# Altium schematic sheet Cpcis_connectors_P4_P5_P6.SchDoc: CPCIS Backplane
size 420 x 297 mm; CheckedBy: A.Paixao; CompanyName: CERN; DrawnBy: G. Daniluk; Engineer: G. Daniluk; Organization: CERN; Address1: European Organization for Nuclear Research; Address2: CH-1211 Genève 23 - Switzerland; DocumentNumber: 19; Revision: -; SheetNumber: 19; SheetTotal: 19; EDA_Number: EDA-03828-V1-0; Projet: DIOT Demonstrator System Board (based on C-GEFE v1); ModifiedBy: G. Daniluk; CheckedDate: 18/06/2018; Title2: P5 to P6; DivGrp: BE/CO; Designer: G. Daniluk; ModifiedDate: -
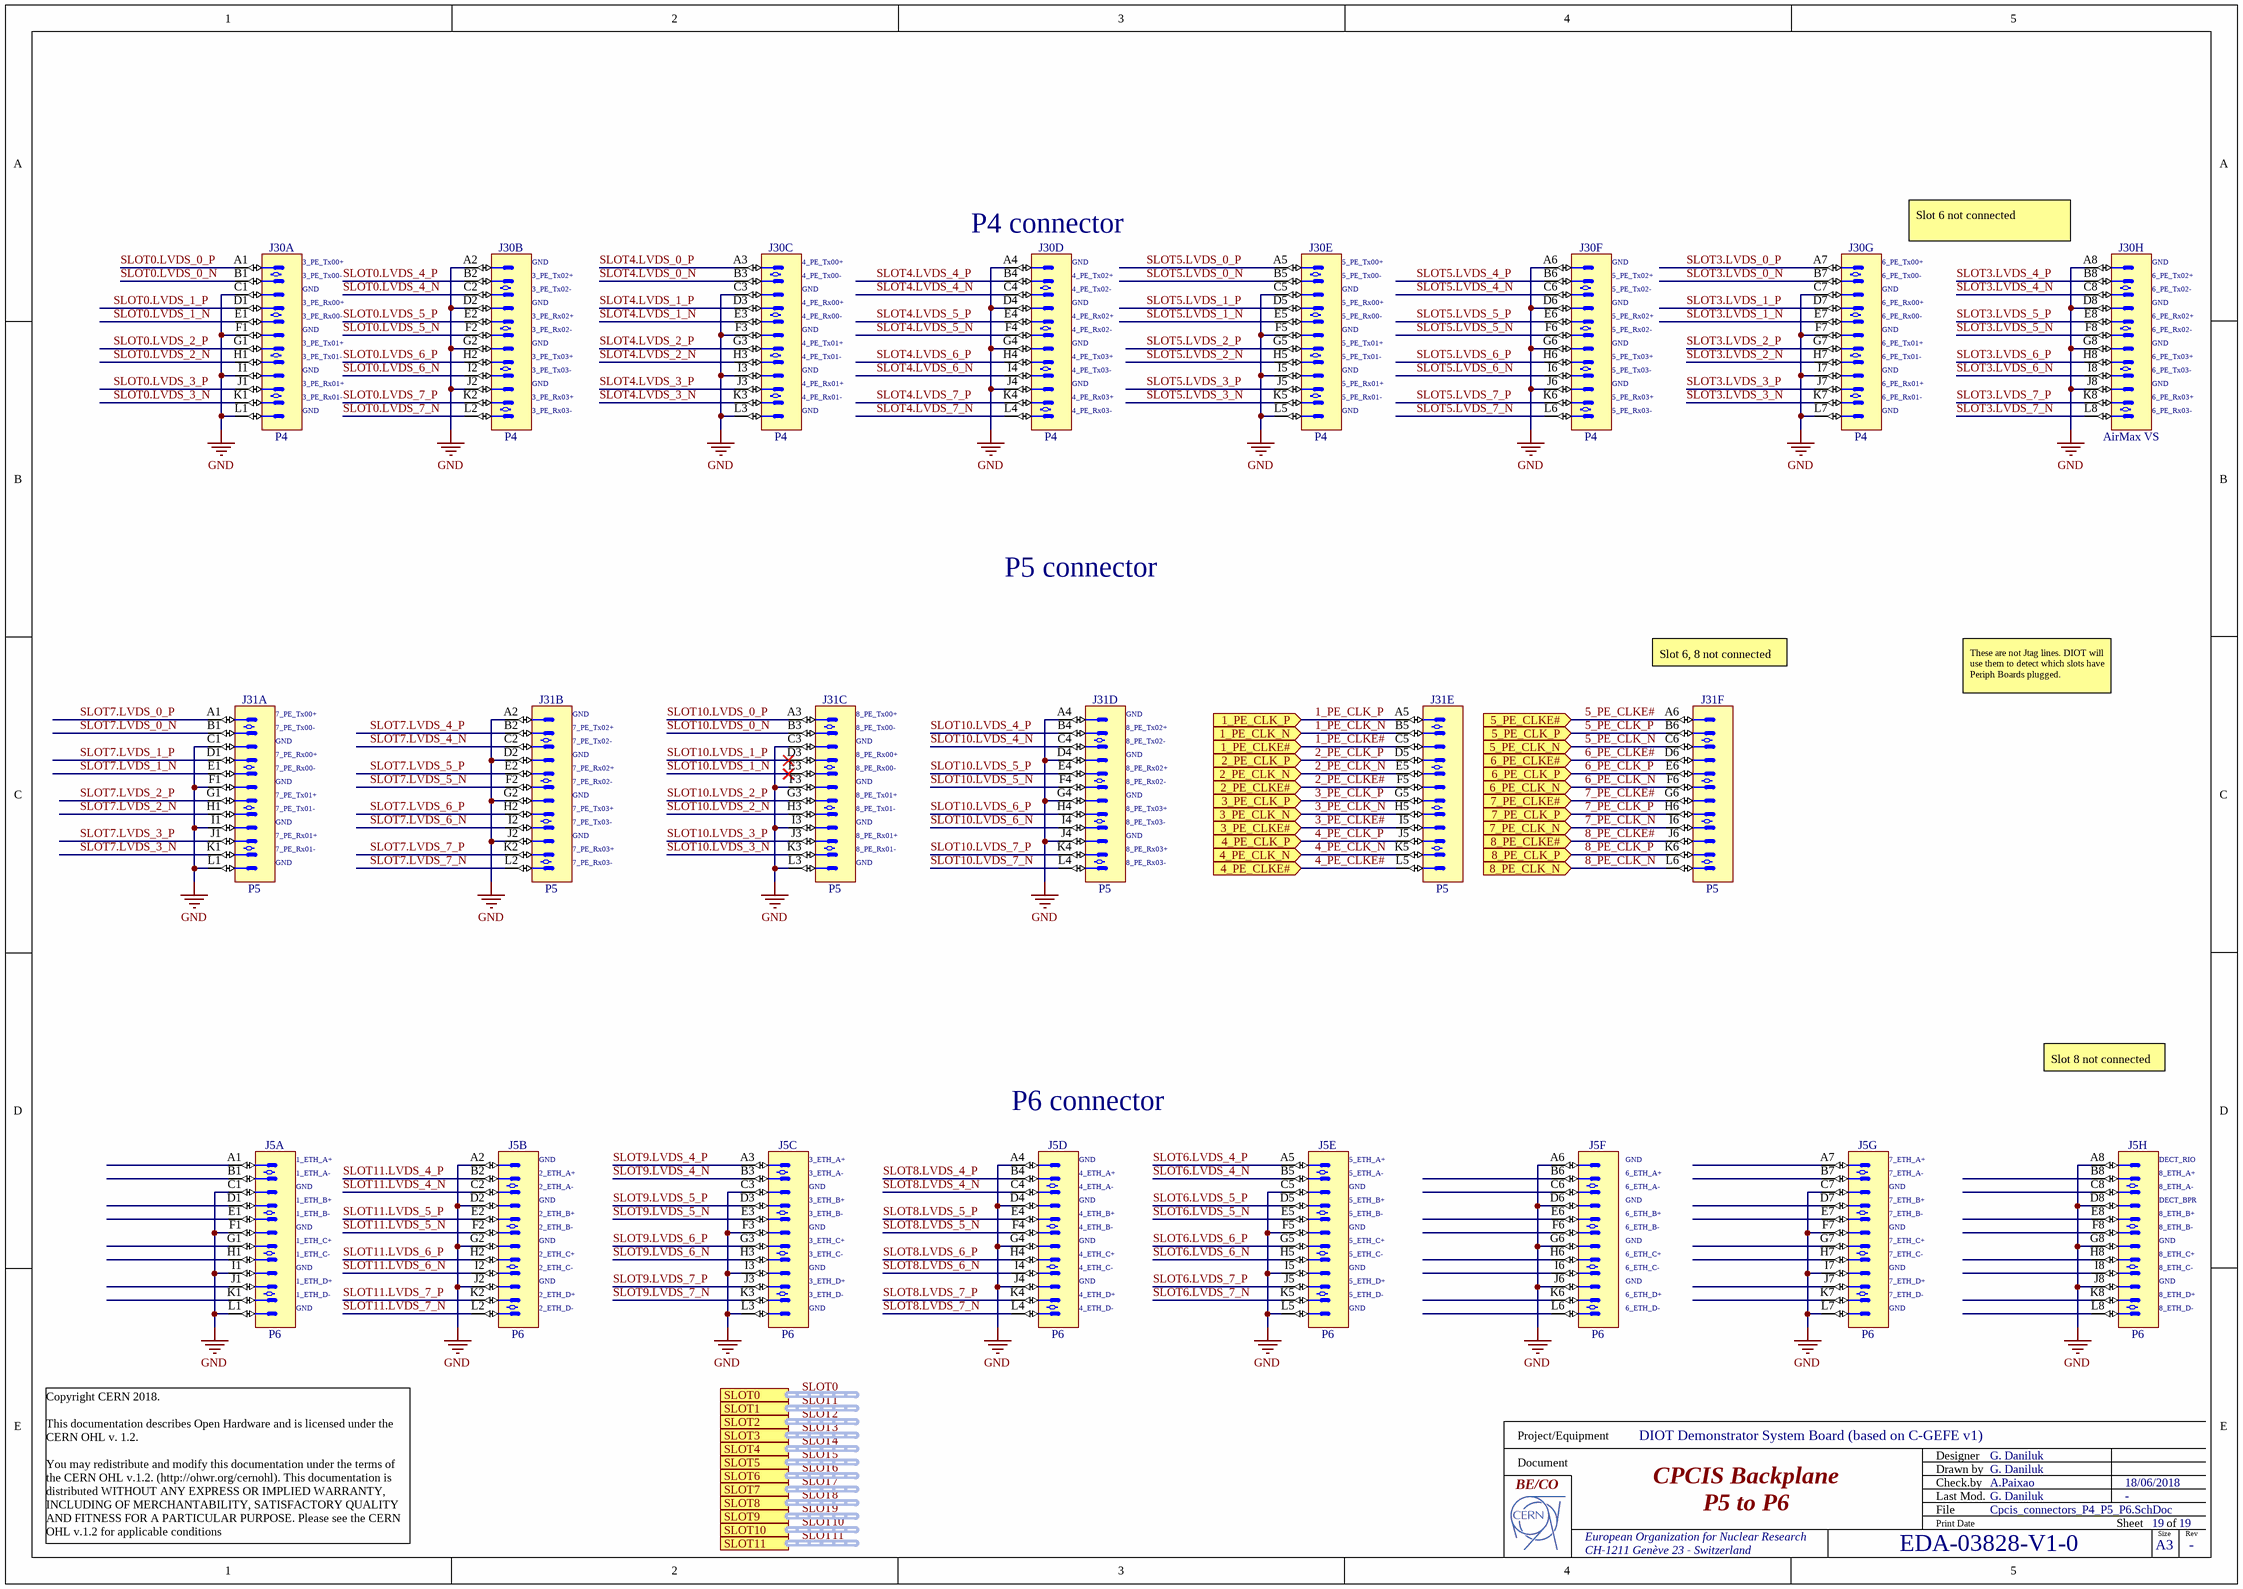
[diagram p0: Cpcis_connectors_P4_P5_P6.SchDoc]

## Parts
J5  P6  [AMPHENOL_10052838-101LF]  (parts A,B,C,D,E,F,G,H of 8)
J30  P4  [AMPHENOL_10052837-101LF]  (parts A,B,C,D,E,F,G,H of 8)
J31  P5  [AMPHENOL_10052824-101LF]  (parts A,B,C,D,E,F of 6)

## Ports
1_PE_CLK_N (in), 1_PE_CLK_P (in), 1_PE_CLKE# (in), 2_PE_CLK_N (in), 2_PE_CLK_P (in), 2_PE_CLKE# (in), 3_PE_CLK_N (in), 3_PE_CLK_P (in), 3_PE_CLKE# (in), 4_PE_CLK_N (in), 4_PE_CLK_P (in), 4_PE_CLKE# (in), 5_PE_CLK_N (in), 5_PE_CLK_P (in), 5_PE_CLKE# (in), 6_PE_CLK_N (in), 6_PE_CLK_P (in), 6_PE_CLKE# (in), 7_PE_CLK_N (in), 7_PE_CLK_P (in), 7_PE_CLKE# (in), 8_PE_CLK_N (in), 8_PE_CLK_P (in), 8_PE_CLKE# (in), SLOT0 (harness ExtensionConnector), SLOT1 (harness ExtensionConnector), SLOT2 (harness ExtensionConnector), SLOT3 (harness ExtensionConnector), SLOT4 (harness ExtensionConnector), SLOT5 (harness ExtensionConnector), SLOT6 (harness ExtensionConnector), SLOT7 (harness ExtensionConnector), SLOT8 (harness ExtensionConnector), SLOT9 (harness ExtensionConnector), SLOT10 (harness ExtensionConnector), SLOT11 (harness ExtensionConnector)

## Nets
GND: J5.A2 J5.A4 J5.A6 J5.A8 J5.C1 J5.C3 J5.C5 J5.C7 J5.D2 J5.D4 J5.D6 J5.D8 J5.F1 J5.F3 J5.F5 J5.F7 J5.G2 J5.G4 J5.G6 J5.G8 J5.I1 J5.I3 J5.I5 J5.I7 J5.J2 J5.J4 J5.J6 J5.J8 J5.L1 J5.L3 J5.L5 J5.L7 J30.A2 J30.A4 J30.A6 J30.A8 J30.C1 J30.C3 J30.C5 J30.C7 J30.D2 J30.D4 J30.D6 J30.D8 J30.F1 J30.F3 J30.F5 J30.F7 J30.G2 J30.G4 J30.G6 J30.G8 J30.I1 J30.I3 J30.I5 J30.I7 J30.J2 J30.J4 J30.J6 J30.J8 J30.L1 J30.L3 J30.L5 J30.L7 J31.A2 J31.A4 J31.C1 J31.C3 J31.D2 J31.D4 J31.F1 J31.F3 J31.G2 J31.G4 J31.I1 J31.I3 J31.J2 J31.J4 J31.L1 J31.L3
1_PE_CLK_N: J31.B5 ; port 1_PE_CLK_N
1_PE_CLK_P: J31.A5 ; port 1_PE_CLK_P
1_PE_CLKE#: J31.C5 ; port 1_PE_CLKE#
2_PE_CLK_N: J31.E5 ; port 2_PE_CLK_N
2_PE_CLK_P: J31.D5 ; port 2_PE_CLK_P
2_PE_CLKE#: J31.F5 ; port 2_PE_CLKE#
3_PE_CLK_N: J31.H5 ; port 3_PE_CLK_N
3_PE_CLK_P: J31.G5 ; port 3_PE_CLK_P
3_PE_CLKE#: J31.I5 ; port 3_PE_CLKE#
4_PE_CLK_N: J31.K5 ; port 4_PE_CLK_N
4_PE_CLK_P: J31.J5 ; port 4_PE_CLK_P
4_PE_CLKE#: J31.L5 ; port 4_PE_CLKE#
5_PE_CLK_N: J31.C6 ; port 5_PE_CLK_N
5_PE_CLK_P: J31.B6 ; port 5_PE_CLK_P
5_PE_CLKE#: J31.A6 ; port 5_PE_CLKE#
6_PE_CLK_N: J31.F6 ; port 6_PE_CLK_N
6_PE_CLK_P: J31.E6 ; port 6_PE_CLK_P
6_PE_CLKE#: J31.D6 ; port 6_PE_CLKE#
7_PE_CLK_N: J31.I6 ; port 7_PE_CLK_N
7_PE_CLK_P: J31.H6 ; port 7_PE_CLK_P
7_PE_CLKE#: J31.G6 ; port 7_PE_CLKE#
8_PE_CLK_N: J31.L6 ; port 8_PE_CLK_N
8_PE_CLK_P: J31.K6 ; port 8_PE_CLK_P
8_PE_CLKE#: J31.J6 ; port 8_PE_CLKE#
SLOT0.LVDS_0_N: J30.B1
SLOT0.LVDS_0_P: J30.A1
SLOT0.LVDS_1_N: J30.E1
SLOT0.LVDS_1_P: J30.D1
SLOT0.LVDS_2_N: J30.H1
SLOT0.LVDS_2_P: J30.G1
SLOT0.LVDS_3_N: J30.K1
SLOT0.LVDS_3_P: J30.J1
SLOT0.LVDS_4_N: J30.C2
SLOT0.LVDS_4_P: J30.B2
SLOT0.LVDS_5_N: J30.F2
SLOT0.LVDS_5_P: J30.E2
SLOT0.LVDS_6_N: J30.I2
SLOT0.LVDS_6_P: J30.H2
SLOT0.LVDS_7_N: J30.L2
SLOT0.LVDS_7_P: J30.K2
SLOT3.LVDS_0_N: J30.B7
SLOT3.LVDS_0_P: J30.A7
SLOT3.LVDS_1_N: J30.E7
SLOT3.LVDS_1_P: J30.D7
SLOT3.LVDS_2_N: J30.H7
SLOT3.LVDS_2_P: J30.G7
SLOT3.LVDS_3_N: J30.K7
SLOT3.LVDS_3_P: J30.J7
SLOT3.LVDS_4_N: J30.C8
SLOT3.LVDS_4_P: J30.B8
SLOT3.LVDS_5_N: J30.F8
SLOT3.LVDS_5_P: J30.E8
SLOT3.LVDS_6_N: J30.I8
SLOT3.LVDS_6_P: J30.H8
SLOT3.LVDS_7_N: J30.L8
SLOT3.LVDS_7_P: J30.K8
SLOT4.LVDS_0_N: J30.B3
SLOT4.LVDS_0_P: J30.A3
SLOT4.LVDS_1_N: J30.E3
SLOT4.LVDS_1_P: J30.D3
SLOT4.LVDS_2_N: J30.H3
SLOT4.LVDS_2_P: J30.G3
SLOT4.LVDS_3_N: J30.K3
SLOT4.LVDS_3_P: J30.J3
SLOT4.LVDS_4_N: J30.C4
SLOT4.LVDS_4_P: J30.B4
SLOT4.LVDS_5_N: J30.F4
SLOT4.LVDS_5_P: J30.E4
SLOT4.LVDS_6_N: J30.I4
SLOT4.LVDS_6_P: J30.H4
SLOT4.LVDS_7_N: J30.L4
SLOT4.LVDS_7_P: J30.K4
SLOT5.LVDS_0_N: J30.B5
SLOT5.LVDS_0_P: J30.A5
SLOT5.LVDS_1_N: J30.E5
SLOT5.LVDS_1_P: J30.D5
SLOT5.LVDS_2_N: J30.H5
SLOT5.LVDS_2_P: J30.G5
SLOT5.LVDS_3_N: J30.K5
SLOT5.LVDS_3_P: J30.J5
SLOT5.LVDS_4_N: J30.C6
SLOT5.LVDS_4_P: J30.B6
SLOT5.LVDS_5_N: J30.F6
SLOT5.LVDS_5_P: J30.E6
SLOT5.LVDS_6_N: J30.I6
SLOT5.LVDS_6_P: J30.H6
SLOT5.LVDS_7_N: J30.L6
SLOT5.LVDS_7_P: J30.K6
SLOT6.LVDS_4_N: J5.B5
SLOT6.LVDS_4_P: J5.A5
SLOT6.LVDS_5_N: J5.E5
SLOT6.LVDS_5_P: J5.D5
SLOT6.LVDS_6_N: J5.H5
SLOT6.LVDS_6_P: J5.G5
SLOT6.LVDS_7_N: J5.K5
SLOT6.LVDS_7_P: J5.J5
SLOT7.LVDS_0_N: J31.B1
SLOT7.LVDS_0_P: J31.A1
SLOT7.LVDS_1_N: J31.E1
SLOT7.LVDS_1_P: J31.D1
SLOT7.LVDS_2_N: J31.H1
SLOT7.LVDS_2_P: J31.G1
SLOT7.LVDS_3_N: J31.K1
SLOT7.LVDS_3_P: J31.J1
SLOT7.LVDS_4_N: J31.C2
SLOT7.LVDS_4_P: J31.B2
SLOT7.LVDS_5_N: J31.F2
SLOT7.LVDS_5_P: J31.E2
SLOT7.LVDS_6_N: J31.I2
SLOT7.LVDS_6_P: J31.H2
SLOT7.LVDS_7_N: J31.L2
SLOT7.LVDS_7_P: J31.K2
SLOT8.LVDS_4_N: J5.C4
SLOT8.LVDS_4_P: J5.B4
SLOT8.LVDS_5_N: J5.F4
SLOT8.LVDS_5_P: J5.E4
SLOT8.LVDS_6_N: J5.I4
SLOT8.LVDS_6_P: J5.H4
SLOT8.LVDS_7_N: J5.L4
SLOT8.LVDS_7_P: J5.K4
SLOT9.LVDS_4_N: J5.B3
SLOT9.LVDS_4_P: J5.A3
SLOT9.LVDS_5_N: J5.E3
SLOT9.LVDS_5_P: J5.D3
SLOT9.LVDS_6_N: J5.H3
SLOT9.LVDS_6_P: J5.G3
SLOT9.LVDS_7_N: J5.K3
SLOT9.LVDS_7_P: J5.J3
SLOT10.LVDS_0_N: J31.B3
SLOT10.LVDS_0_P: J31.A3
SLOT10.LVDS_1_N: J31.E3
SLOT10.LVDS_1_P: J31.D3
SLOT10.LVDS_2_N: J31.H3
SLOT10.LVDS_2_P: J31.G3
SLOT10.LVDS_3_N: J31.K3
SLOT10.LVDS_3_P: J31.J3
SLOT10.LVDS_4_N: J31.C4
SLOT10.LVDS_4_P: J31.B4
SLOT10.LVDS_5_N: J31.F4
SLOT10.LVDS_5_P: J31.E4
SLOT10.LVDS_6_N: J31.I4
SLOT10.LVDS_6_P: J31.H4
SLOT10.LVDS_7_N: J31.L4
SLOT10.LVDS_7_P: J31.K4
SLOT11.LVDS_4_N: J5.C2
SLOT11.LVDS_4_P: J5.B2
SLOT11.LVDS_5_N: J5.F2
SLOT11.LVDS_5_P: J5.E2
SLOT11.LVDS_6_N: J5.I2
SLOT11.LVDS_6_P: J5.H2
SLOT11.LVDS_7_N: J5.L2
SLOT11.LVDS_7_P: J5.K2

Not connected (* = marked no-connect by the designer): J5 A1 A7 B1 B6 B7 B8 C6 C8 D1 D7 E1 E6 E7 E8 F6 F8 G1 G7 H1 H6 H7 H8 I6 I8 J1 J7 K1 K6 K7 K8 L6 L8

## Buses and harness runs
harness SLOT0 = port SLOT0
harness SLOT1 = port SLOT1
harness SLOT2 = port SLOT2
harness SLOT3 = port SLOT3
harness SLOT4 = port SLOT4
harness SLOT5 = port SLOT5
harness SLOT6 = port SLOT6
harness SLOT7 = port SLOT7
harness SLOT8 = port SLOT8
harness SLOT9 = port SLOT9
harness SLOT10 = port SLOT10
harness SLOT11 = port SLOT11

## Notes on the sheet
- (near J30) 3_PE_Tx00+
- (near J30) GND
- (near J30) 4_PE_Tx00+
- (near J30) P4 connector
- (near J30) 5_PE_Tx00+
- (near J30) 6_PE_Tx00+
- (near J30) Slot 6 not connected
- (near J30) 3_PE_Tx00-
- (near J30) 3_PE_Rx00+
- (near J30) 3_PE_Rx00-
- (near J30) 3_PE_Tx02+
- (near J30) 3_PE_Tx02-
- (near J30) 3_PE_Rx02+
- (near J30) 4_PE_Tx00-
- (near J30) 4_PE_Rx00+
- (near J30) 4_PE_Rx00-
- (near J30) 4_PE_Tx02+
- (near J30) 4_PE_Tx02-
- (near J30) 4_PE_Rx02+
- (near J30) 5_PE_Tx00-
- (near J30) 5_PE_Rx00+
- (near J30) 5_PE_Rx00-
- (near J30) 5_PE_Tx02+
- (near J30) 5_PE_Tx02-
- (near J30) 5_PE_Rx02+
- (near J30) 6_PE_Tx00-
- (near J30) 6_PE_Rx00+
- (near J30) 6_PE_Rx00-
- (near J30) 6_PE_Tx02+
- (near J30) 6_PE_Tx02-
- (near J30) 6_PE_Rx02+
- (near J30) 3_PE_Tx01+
- (near J30) 3_PE_Tx01-
- (near J30) 3_PE_Rx01+
- (near J30) 3_PE_Rx01-
- (near J30) 3_PE_Rx02-
- (near J30) 3_PE_Tx03+
- (near J30) 3_PE_Tx03-
- (near J30) 3_PE_Rx03+
- (near J30) 4_PE_Tx01+
- (near J30) 4_PE_Tx01-
- (near J30) 4_PE_Rx01+
- (near J30) 4_PE_Rx01-
- (near J30) 4_PE_Rx02-
- (near J30) 4_PE_Tx03+
- (near J30) 4_PE_Tx03-
- (near J30) 4_PE_Rx03+
- (near J30) 5_PE_Tx01+
- (near J30) 5_PE_Tx01-
- (near J30) 5_PE_Rx01+
- (near J30) 5_PE_Rx01-
- (near J30) 5_PE_Rx02-
- (near J30) 5_PE_Tx03+
- (near J30) 5_PE_Tx03-
- (near J30) 5_PE_Rx03+
- (near J30) 6_PE_Tx01+
- (near J30) 6_PE_Tx01-
- (near J30) 6_PE_Rx01+
- (near J30) 6_PE_Rx01-
- (near J30) 6_PE_Rx02-
- (near J30) 6_PE_Tx03+
- (near J30) 6_PE_Tx03-
- (near J30) 6_PE_Rx03+
- (near J30) 3_PE_Rx03-
- (near J30) 4_PE_Rx03-
- (near J30) 5_PE_Rx03-
- (near J30) 6_PE_Rx03-
- P5 connector
- Slot 6, 8 not connected
- (near J31) 7_PE_Tx00+
- (near J31) 7_PE_Tx00-
- (near J31) GND
- (near J31) 7_PE_Tx02+
- (near J31) 8_PE_Tx00+
- (near J31) 8_PE_Tx00-
- (near J31) 8_PE_Tx02+
- These are not Jtag lines. DIOT will use them to detect which slots have Periph Boards plugged.
- (near J31) 7_PE_Tx01+
- (near J31) 7_PE_Rx00+
- (near J31) 7_PE_Rx00-
- (near J31) 7_PE_Tx02-
- (near J31) 7_PE_Rx02+
- (near J31) 7_PE_Rx02-
- (near J31) 8_PE_Tx01+
- (near J31) 8_PE_Rx00+
- (near J31) 8_PE_Rx00-
- (near J31) 8_PE_Tx02-
- (near J31) 8_PE_Rx02+
- (near J31) 8_PE_Rx02-
- (near J31) 7_PE_Tx01-
- (near J31) 7_PE_Rx01+
- (near J31) 7_PE_Rx01-
- (near J31) 7_PE_Tx03+
- (near J31) 7_PE_Tx03-
- (near J31) 7_PE_Rx03+
- (near J31) 7_PE_Rx03-
- (near J31) 8_PE_Tx01-
- (near J31) 8_PE_Rx01+
- (near J31) 8_PE_Rx01-
- (near J31) 8_PE_Tx03+
- (near J31) 8_PE_Tx03-
- (near J31) 8_PE_Rx03+
- (near J31) 8_PE_Rx03-
- Slot 8 not connected
- (near J5) P6 connector
- (near J5) 1_ETH_A+
- (near J5) 1_ETH_A-
- (near J5) GND
- (near J5) 1_ETH_B+
- (near J5) 2_ETH_A+
- (near J5) 2_ETH_A-
- (near J5) 3_ETH_A+
- (near J5) 3_ETH_A-
- (near J5) 3_ETH_B+
- (near J5) 4_ETH_A+
- (near J5) 4_ETH_A-
- (near J5) 5_ETH_A+
- (near J5) 5_ETH_A-
- (near J5) 5_ETH_B+
- (near J5) 6_ETH_A+
- (near J5) 6_ETH_A-
- (near J5) 7_ETH_A+
- (near J5) 7_ETH_A-
- (near J5) 7_ETH_B+
- (near J5) DECT_RIO
- (near J5) 8_ETH_A+
- (near J5) 8_ETH_A-
- (near J5) DECT_BPR
- (near J5) 1_ETH_B-
- (near J5) 1_ETH_C+
- (near J5) 1_ETH_C-
- (near J5) 2_ETH_B+
- (near J5) 2_ETH_B-
- (near J5) 2_ETH_C+
- (near J5) 2_ETH_C-
- (near J5) 3_ETH_B-
- (near J5) 3_ETH_C+
- (near J5) 3_ETH_C-
- (near J5) 4_ETH_B+
- (near J5) 4_ETH_B-
- (near J5) 4_ETH_C+
- (near J5) 4_ETH_C-
- (near J5) 5_ETH_B-
- (near J5) 5_ETH_C+
- (near J5) 5_ETH_C-
- (near J5) 6_ETH_B+
- (near J5) 6_ETH_B-
- (near J5) 6_ETH_C+
- (near J5) 6_ETH_C-
- (near J5) 7_ETH_B-
- (near J5) 7_ETH_C+
- (near J5) 7_ETH_C-
- (near J5) 8_ETH_B+
- (near J5) 8_ETH_B-
- (near J5) 8_ETH_C+
- (near J5) 8_ETH_C-
- (near J5) 1_ETH_D+
- (near J5) 1_ETH_D-
- (near J5) 2_ETH_D+
- (near J5) 2_ETH_D-
- (near J5) 3_ETH_D+
- (near J5) 3_ETH_D-
- (near J5) 4_ETH_D+
- (near J5) 4_ETH_D-
- (near J5) 5_ETH_D+
- (near J5) 5_ETH_D-
- (near J5) 6_ETH_D+
- (near J5) 6_ETH_D-
- (near J5) 7_ETH_D+
- (near J5) 7_ETH_D-
- (near J5) 8_ETH_D+
- (near J5) 8_ETH_D-
- Copyright CERN 2018.
  This documentation describes Open Hardware and is licensed under the CERN OHL v. 1.2.
  You may redistribute and modify this documentation under the terms of the CERN OHL v.1.2. (http://ohwr.org/cernohl). This documentation is distributed WITHOUT ANY EXPRESS OR IMPLIED WARRANTY, INCLUDING OF MERCHANTABILITY, SATISFACTORY QUALITY AND FITNESS FOR A PARTICULAR PURPOSE. Please see the CERN OHL v.1.2 for applicable conditions
- Project/Equipment
- Document
- Designer
- Drawn by
- Check.by
- File
- Last Mod.
- Print Date
- Sheet
- Size
- A3
- of
- Rev

## Library data of the parts
J5 = AMPHENOL_10052838-101LF: 96 Contacts Header, 8 Columns, 4 Pairs per Column; Part Description: 96 Contacts, 2mm Pitch, 8 Columns, 4 Pairs per Column, 4 Walls, Right Angle Header; Part Number: AMPHENOL_10052838-101LF; Component Kind: Standard; Component Type: Standard; Pin Count: 96; Family: AirMax VS; Mounted: Yes; Socket: No; SMD: No; PressFit: Yes; Sense: No; Status: None; Manufacturer: AMPHENOL; Manufacturer Part Number: 10052838-101LF; ComponentHeight: 15.35mm; HelpURL: \\cern.ch\dfs\Applications\Altium\Datasheets\AMPHENOL_10052838-101LF.pdf; ComponentLink1URL: \\cern.ch\dfs\Applications\Altium\Datasheets\AMPHENOL_10052838-101LF_Application.pdf; ComponentLink1Description: Application; Author: CERN DEM MR; CreateDate: 19/02/2018; LatestRevisionDate: 19/02/2018; Classname: Overlapping
J30 = AMPHENOL_10052837-101LF: 96 Contacts Header, 8 Columns, 4 Pairs per Column; Part Description: 96 Contacts, 2mm Pitch, 8 Columns, 4 Pairs per Column, 2 Walls, Right Angle Header; Part Number: AMPHENOL_10052837-101LF; Component Kind: Standard; Component Type: Standard; Pin Count: 96; Family: AirMax VS; Mounted: Yes; Socket: No; SMD: No; PressFit: Yes; Sense: No; Status: None; Manufacturer: AMPHENOL; Manufacturer Part Number: 10052837-101LF; ComponentHeight: 15.35mm; HelpURL: \\cern.ch\dfs\Applications\Altium\Datasheets\AMPHENOL_10052837-101LF.pdf; ComponentLink1URL: \\cern.ch\dfs\Applications\Altium\Datasheets\AMPHENOL_10052837-101LF_Application.pdf; ComponentLink1Description: Application; Author: CERN DEM MR; CreateDate: 19/02/2018; LatestRevisionDate: 19/02/2018
J31 = AMPHENOL_10052824-101LF: 72 Contacts Header, 6 Columns, 4 Pairs per Column; Part Description: 72 Contacts, 2mm Pitch, 6 Columns, 4 Pairs per Column, 2 Walls, Right Angle Header; Part Number: AMPHENOL_10052824-101LF; Component Kind: Standard; Component Type: Standard; Pin Count: 72; Family: AirMax VS; Mounted: Yes; Socket: No; SMD: No; PressFit: Yes; Sense: No; Status: None; Manufacturer: AMPHENOL; Manufacturer Part Number: 10052824-101LF; ComponentHeight: 15.35mm; HelpURL: \\cern.ch\dfs\Applications\Altium\Datasheets\AMPHENOL_10052824-101LF.pdf; ComponentLink1URL: \\cern.ch\dfs\Applications\Altium\Datasheets\AMPHENOL_10052824-101LF_Application.pdf; ComponentLink1Description: Application; Author: CERN DEM JMW; CreateDate: 29/11/2017; LatestRevisionDate: 29/11/2017